# EasyEDA Pro project CerberusZero_V1.epro

# Schematic Schematic1
Board Name: CerberusBeta; Create Date: 2026-01-13; Page Name: USBkillerFrontend; Project Name: Cerberus; Schematic Name: Schematic1; Update Date: 2026-03-24; Company: Glitchboi; Page Size: A4; Version: V1.0
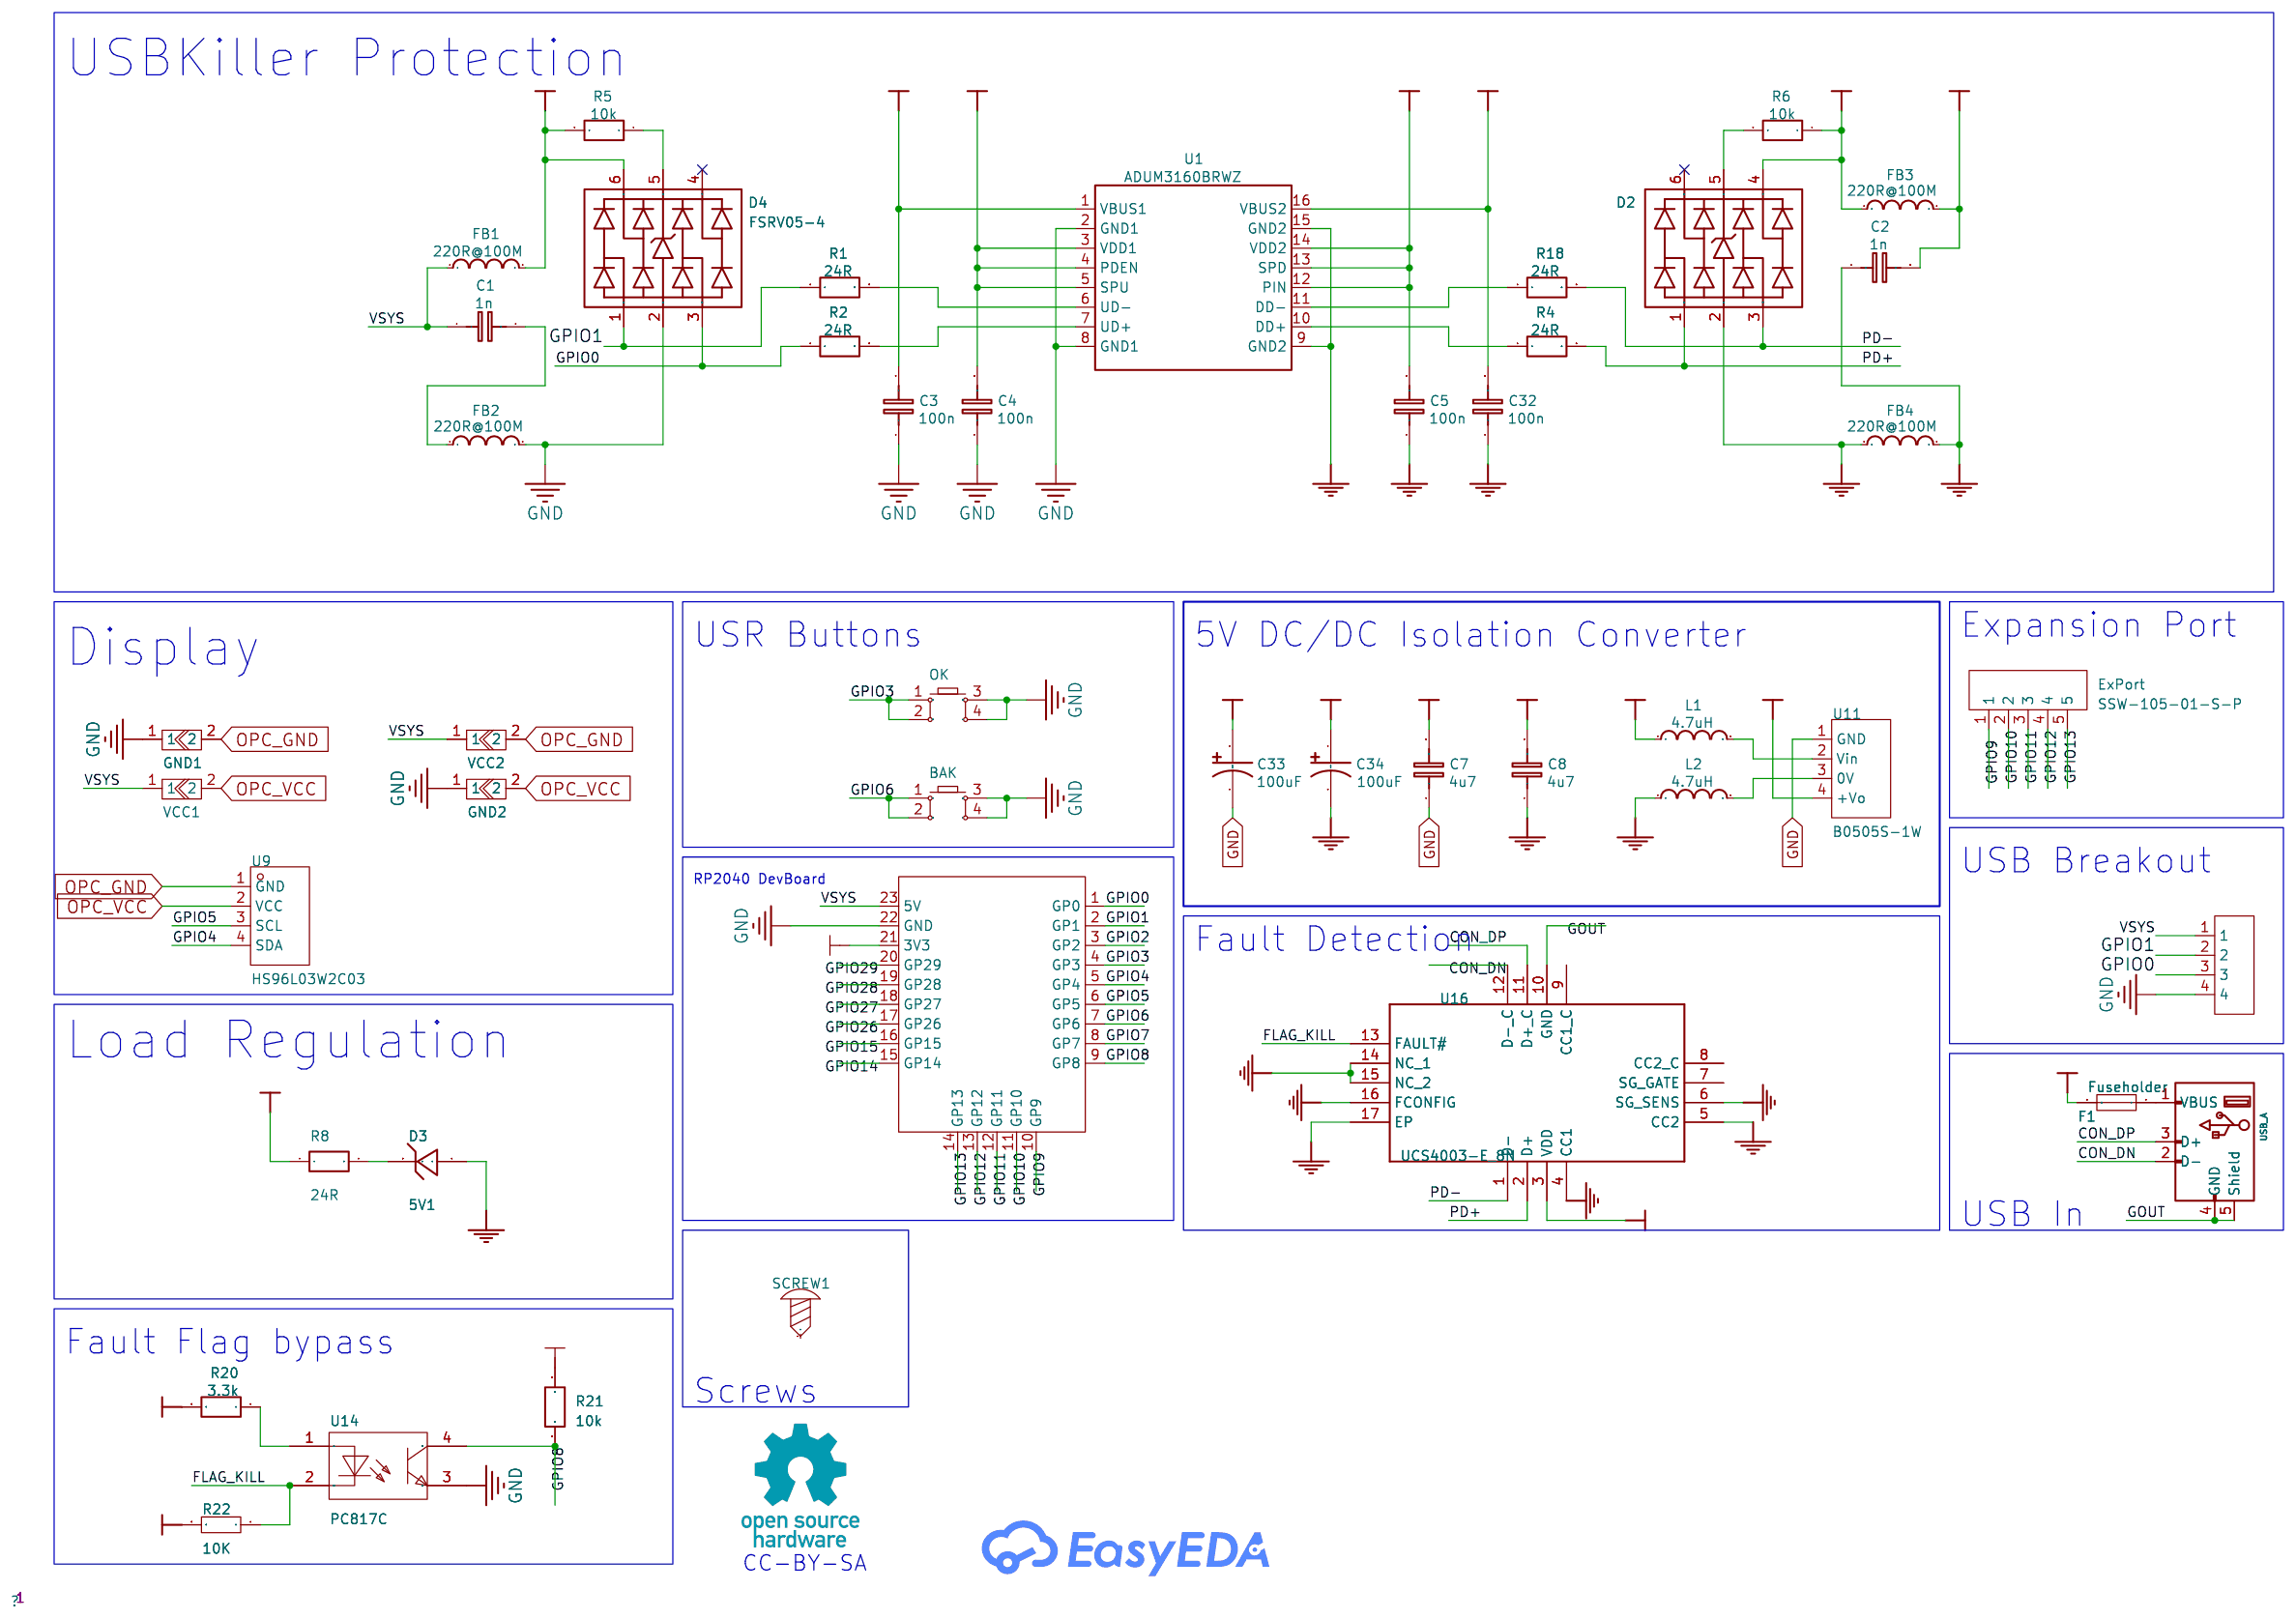
[diagram p0: schematic sheet]

## Parts
BAK  PTS815SJK250SMTRLFS  [SW-SMD_4P-L4.2-W3.3-P2.15-LS5.1]
C1  1n  [C0805]
C2  1n  [C0805]
C3  100n  [C1206]
C4  100n  [C1206]
C5  100n  [C1206]
C7  4u7  [C0603]
C8  4u7  [C0603]
C32  100n  [C1206]
C33  100uF  [C0805]
C34  100uF  [C0805]
D2  FSRV05-4  [SOT-23-6_L2.9-W1.6-P0.95-LS2.8-BL]
D3  5V1  [D1206-RD_S13773]
D4  FSRV05-4  [SRV05-4]
ExPort  SSW-105-01-S-P  [HDR-TH_5P-P2.54_SSW-105-01-S-P]
F1  Fuseholder  [FUSE-SMD_L9.7-W5.0]
FB1  220Ω  [L0603]
FB2  220Ω  [L0603]
FB3  220Ω  [L0603]
FB4  220Ω  [L0603]
GND1  -  [Solder Jumper 0402]
GND2  -  [Solder Jumper 0402]
L1  220Ω  [L0603]
L2  220Ω  [L0603]
OK  PTS815SJK250SMTRLFS  [SW-SMD_4P-L4.2-W3.3-P2.15-LS5.1]
R1  24R  [R1206_1]
R2  24R  [R1206_1]
R4  24R  [R1206_1]
R5  10k  [RES-SMD_L3.2-W1.6_HCS1206FTL500]
R6  10k  [RES-SMD_L3.2-W1.6_HCS1206FTL500]
R8  24R  [R1206_1]
R18  24R  [R1206_1]
R20  3.3k  [RES-SMD_L3.2-W1.6_HCS1206FTL500]
R21  10k  [RES-SMD_L3.2-W1.6_HCS1206FTL500]
R22  10K  [R0603]
SCREW1  -  [SMD_BD6.0-D4.2]
U1  ADUM3160BRWZ  [SOIC-16_L10.3-W7.5-P1.27-LS10.3-TL]
U9  HS96L03W2C03  [OLED-TH_L27.8-W27.2-P2.54_C9900033791]
U11  B0505S-1W  [PWRM-TH_BXXXXS-1W]
U14  PC817C  [DIP-4_L4.6-W6.5-P2.54-LS7.6-BL]
U15  RP2040-Zero  [COMM-SMD_RP2040-ZERO]
U16  UCS4003-E_8N  [QFN50P300X300X100-17N]
USB_B  HX PH254-01-04-Z-L11.5 straight pin header  [HDR-TH_4P-HX-PH254-01-04-Z-L11.5]
USB_IN1  USB_A  [usbCondom:875832010BLF]
VCC1  -  [Solder Jumper 0402]
VCC2  -  [Solder Jumper 0402]

## Library data of the parts
BAK OK = PTS815SJK250SMTRLFS: 操作寿命10万次，使用温度-20°C 至 70°C,尺寸4.20mmx3.20mmx2.50mm，操作力度2.5N; LCSC Part Name: 轻触开关; Supplier Part: C918859; Manufacturer: C&K; Supplier Footprint: SMD; JLCPCB Part Class: 扩展库; Datasheet: https://atta.szlcsc.com/upload/public/pdf/source/20190916/C411883_4F77F16E1D8E48DC707D8949CEE7CF80.pdf; Supplier: LCSC
C1 C2 = 1n: Manufacturer Part: CL10B102KB8NNNC; Supplier: LCSC; Manufacturer: SAMSUNG; Supplier Part: C1588; nameAlias: Value(F); spicePre: C; spiceSymbolName: Cap_0603_EU
C3-C5 C32 = 100n: Manufacturer Part: CC0603KRX7R9BB104; Supplier: LCSC; Manufacturer: YAGEO; Supplier Part: C14663; nameAlias: Value(F); spicePre: C; spiceSymbolName: Cap_0603_EU
C7 C8 = 4u7: Manufacturer Part: CL10A475KO8NNNC; Supplier: LCSC; Manufacturer: SAMSUNG; Supplier Part: C19666; nameAlias: Value(F); spicePre: C; spiceSymbolName: Cap_0603_EU
C33 C34 = 100uF: Supplier: LCSC; Supplier Part: C68621; Manufacturer: AVX; Manufacturer Part: TAJC107M016RNJ; JLCPCB Part Class: Extended Part; nameAlias: Capacitance; Contributor: LCSC; spicePre: C; spiceSymbolName: TAJC107M016RNJ
D2 = FSRV05-4: Polarity:Unidirectional Reverse Stand-Off Voltage (Vrwm):5V Clamping Voltage:18V Peak Pulse Current (Ipp):17A Peak Pulse Power Dissipation (Ppp):300W Voltage - Breakdown:7.5V Reverse Leakage Current (Ir):500nA Number of Channels:4 Operating Temperature:-5; LCSC Part Name: 单向ESD 5V截止 峰值浪涌电流：17A; Supplier Part: C908218; Manufacturer: FUXINSEMI(富芯森美); Supplier Footprint: SOT-23-6L; JLCPCB Part Class: Extended Part; Datasheet: https://item.szlcsc.com/datasheet/FSRV05-4/974460.html; Supplier: LCSC; Polarity: Unidirectional; Reverse Stand-Off Voltage (Vrwm): 5V; Clamping Voltage: 18V; Peak Pulse Current (Ipp): 17A; Peak Pulse Power Dissipation (Ppp): 300W; Voltage - Breakdown: 7.5V; Reverse Leakage Current (Ir): 500nA; Number of Channels: 4; Operating Temperature: -55℃~+125℃; level of protection: IEC 61000-4-5；IEC 61000-4-2; Type: ESD; Junction Capacitance: 0.6pF；0.3pF
D3 = 5V1: Supplier: LCSC; Supplier Part: C81601; Manufacturer: SEMTECH; Manufacturer Part: MM1Z5V1; JLCPCB Part Class: Extend; Contributor: LCSC; LCSC Assembly: Yes; spicePre: D
D4 = FSRV05-4: Manufacturer: FUXINSEMI; Supplier: LCSC; Supplier Part: C908218; Contributor: Stefan Wagner; spicePre: D
ExPort = SSW-105-01-S-P: Pitch:2.54mm Mounting Type:Through Hole Number of Rows:1 Number of Positions:5P Current Rating:4.7A Insulation Height:8.51mm Contact Plating:Tin Operating Temperature:-55℃~+125℃ Operating Temperature:-55℃~+125℃; LCSC Part Name: 间距:2.54mm 直插; Supplier Part: C7322316; Manufacturer: SAMTEC; Supplier Footprint: 插件,P=2.54mm; JLCPCB Part Class: Extended Part; Datasheet: https://atta.szlcsc.com/upload/public/pdf/source/20241016/2BF0BBB15656BB1F7E298D38069FE170.pdf; Supplier: LCSC; Pitch: 2.54mm; Mounting Type: Through Hole; Number of Rows: 1; Number of Positions: 5P; Current Rating: 4.7A; Insulation Height: 8.51mm; Contact Plating: Tin; Operating Temperature: -55℃~+125℃
F1 = 1808 SMD Fuseholder: Supplier Part: C9900157015; Supplier Footprint: SMD-2P; JLCPCB Part Class: Extended Part; Supplier: LCSC
FB1-FB4 = 220R@100M: Supplier Part: C98304; Supplier: LCSC; Manufacturer: Sunlord; Manufacturer Part: UPZ1608E221-2R0TF; JLCPCB Part Class: Extended Part; nameAlias: Value(H); spicePre: L; spiceSymbolName: UPZ1608E221-2R0TF
GND1 GND2 VCC1 VCC2 = Solder Jumper: Solder Jumper for 0402 components
L1 L2 = 4.7uH: Supplier Part: C295681; Supplier: LCSC; Manufacturer: Chilisin Elec; Manufacturer Part: CPY160808T-4R7M-NP; JLCPCB Part Class: Extended Part; nameAlias: Value(H); spicePre: L; spiceSymbolName: UPZ1608E221-2R0TF
R1 R2 R4 R8 R18 = 24R: Manufacturer Part: 0603WAF240JT5E; Supplier: LCSC; Manufacturer: UniOhm; Supplier Part: C4198; nameAlias: Value(Ω); spicePre: R; spiceSymbolName: Res_0603(1/10W)_EU
R5 R6 R20 R21 = 10k: Manufacturer Part: 0603WAF1002T5E; Supplier: LCSC; Manufacturer: UniOhm; Supplier Part: C25804; nameAlias: Value(Ω); spicePre: R; spiceSymbolName: Res_0805(1/8W)_EU
R22 = Res_0603: Supplier Footprint: 0603
SCREW1 = Screw-Hole-M3: Supplier Footprint: 插件
U1 = ADUM3160BRWZ: Supplier: LCSC; Manufacturer: ADI; Supplier Part: C108501; JLCPCB Part Class: Extended Part; Contributor: LCSC; spicePre: U
U9 = HS96L03W2C03: Main Control Chip:SSD1315 Interface Type:I2C Size:0.96 Pixel Resolution:128x64 Operating Temperature:-40℃~+70℃ Operating Temperature:-40℃~+70℃; LCSC Part Name: 0.96寸OLED显示屏窄白光IIC; Supplier Part: C5248080; Manufacturer: HS(汉昇); JLCPCB Part Class: Extended Part; Datasheet: https://atta.szlcsc.com/upload/public/pdf/source/20230627/763D01F79A90007632F098068C7C8AD9.pdf; Supplier: LCSC; Main Control Chip: SSD1315; Interface Type: I2C; Size: 0.96; Pixel Resolution: 128x64; Operating Temperature: -40℃~+70℃
U11 = B0505S-1W_C2880020: Number of Outputs:1 Output Power:1W Voltage - Supply:5.5V Voltage - Supply:5.5V Conversion Efficiency:70% Conversion Efficiency:70% Output Voltage:5V Output Voltage:5V Output Current(Max):200mA Output Current(Max):200mA Capacitive Load(Max):100uF Isolatio; LCSC Part Name: DC-DC 电源模块; Supplier Part: C2880020; Manufacturer: TESL*A(清远特斯拉); Supplier Footprint: SIP,11.6x6mm; JLCPCB Part Class: Extended Part; Datasheet: https://item.szlcsc.com/datasheet/B0505S-1W/3089557.html; Supplier: LCSC; Number of Outputs: 1; Output Power: 1W; Voltage - Supply: 5.5V; Conversion Efficiency: 70%; Output Voltage: 5V; Output Current(Max): 200mA; Capacitive Load(Max): 100uF; Isolation Voltage(Vrms): 1kV; Operating Temperature: -40℃~+85℃; Ripple Noise: 50mVp-p; Length: 11.6mm; Width: 6mm; Height: 10mm
U14 = PC817C_C20612449: Input type:DC Output Type:Phototransistor Voltage - Forward(Vf):1.2V Output Current:50mA Isolation Voltage(Vrms):5kV Reverse Voltage:6V Load Voltage:35V Number of Outputs:1 Vce Saturation(VCE(sat)):100mV@20mA,1mA Rise time:18us Fall time:18us Operating Te; LCSC Part Name: 4引脚DIP封装光电晶体管光电耦合器; Supplier Part: C20612449; Manufacturer: KTP(科泰普); Supplier Footprint: DIP-4; JLCPCB Part Class: Extended Part; Datasheet: https://item.szlcsc.com/datasheet/PC817C/21971288.html; Supplier: LCSC; Input type: DC; Output Type: Phototransistor; Voltage - Forward(Vf): 1.2V; Output Current: 50mA; Isolation Voltage(Vrms): 5kV; Reverse Voltage: 6V; Load Voltage: 35V; Number of Outputs: 1; Vce Saturation(VCE(sat)): 100mV@20mA,1mA; Rise time: 18us; Fall time: 18us; Operating Temperature: -55℃~+110℃; Current Transfer Ratio (CTR) Minimum: 200%; Current Transfer Ratio (CTR) Maximum/Saturation Value: 400%; Total Power Dissipation(Pd): 200mW; Forward Current(If): 60mA
U15 = RP2040-Zero: LCSC Part Name: 微雪 树莓派RP2040-Zero微控制器 PICO开发板 RP2040双核处理器; Supplier Part: C5350143; Manufacturer: Waveshare(微雪电子); JLCPCB Part Class: Extended Part; Datasheet: https://item.szlcsc.com/datasheet/RP2040-Zero/6136910.html; Supplier: LCSC
U16 = UCS4003-E_8N: USB Interface IC USB Type-C Port Protector
USB_B = HX PH254-01-04-Z-L11.5 straight pin header: Pin Structure:1x4P Pitch:2.54mm Circluar Pins/Square Pins:Pin Header Mounting Type:Through Hole Number of Rows:1 Number of Pins:4P Current Rating:3A Voltage Rating (Max):1kV Length of Mating Pin:6mm Insulation Height:2.5mm Length of End Connection Pin:3mm; LCSC Part Name: 1x4P 间距:2.54mm 方针 直插; Supplier Part: C52016392; Manufacturer: hanxia(韩下); Supplier Footprint: 插件,P=2.54mm; JLCPCB Part Class: Extended Part; Datasheet: https://item.szlcsc.com/datasheet/HX%2520PH254-01-04-Z-L11.5%2520straight%2520pin%2520header/54760437.html; Supplier: LCSC; Pin Structure: 1x4P; Pitch: 2.54mm; Circluar Pins/Square Pins: Pin Header; Mounting Type: Through Hole; Number of Rows: 1; Number of Pins: 4P; Current Rating: 3A; Voltage Rating (Max): 1kV; Length of Mating Pin: 6mm; Insulation Height: 2.5mm; Length of End Connection Pin: 3mm; Contact Material: Brass; Contact Plating: Gold; Operating Temperature: -40℃~+105℃
USB_IN1 = Connector_USB_A: Attribute1: J2; LCSC#: C599118

## Nets
3V3: R21.2 U15.21(3V3)
GND: BAK.3 BAK.4 C3.1 C4.1 C7.1 C33.2 D4.2 FB2.2 GND1.1 GND2.1 OK.3 OK.4 U1.2(GND1) U1.8(GND1) U11.1(GND) U14.3(EM) U15.22(GND) USB_B.4
GND2: C5.1 C8.1 C32.1 C34.2 D2.2 FB4.1 L2.1 U1.9(GND2) U1.15(GND2) U16.4(CC1) U16.5(CC2) U16.6(SG_SENS) U16.14(NC_1) U16.15(NC_2) U16.16(FCONFIG) U16.17(EP)
VBUS1: C3.2 C7.2 C33.1 D4.6 FB1.2 L1.1 R5.2 U1.1(VBUS1)
VBUS2: C8.2 C32.2 C34.1 D2.4 FB3.1 R6.1 R20.2 R22.2 U1.16(VBUS2) U11.4(+Vo) U16.3(VDD)
VDD1: C4.2 U1.3(VDD1) U1.4(PDEN) U1.5(SPU)
VDD2: C5.2 U1.12(PIN) U1.13(SPD) U1.14(VDD2)
CON_DN: U16.12(D-_C) USB_IN1.2(D-)
CON_DP: U16.11(D+_C) USB_IN1.3(D+)
FLAG_KILL: R22.1 U14.2(CAT) U16.13(FAULT#)
GOUT: C2.1 D3.1(A) FB4.2 U16.10(GND) USB_IN1.4(GND) USB_IN1.5(Shield)
GPIO0: D4.3 R2.1 U15.1(GP0) USB_B.3
GPIO1: D4.1 R1.1 U15.2(GP1) USB_B.2
GPIO2: U15.3(GP2)
GPIO3: OK.1 OK.2 U15.4(GP3)
GPIO4: U9.4(SDA) U15.5(GP4)
GPIO5: U9.3(SCL) U15.6(GP5)
GPIO6: BAK.1 BAK.2 U15.7(GP6)
GPIO7: U15.8(GP7)
GPIO8: R21.1 U14.4(COL) U15.9(GP8)
GPIO9: ExPort.1 U15.10(GP9)
GPIO10: ExPort.2 U15.11(GP10)
GPIO11: ExPort.3 U15.12(GP11)
GPIO12: ExPort.4 U15.13(GP12)
GPIO13: ExPort.5 U15.14(GP13)
GPIO14: U15.15(GP14)
GPIO15: U15.16(GP15)
GPIO26: U15.17(GP26)
GPIO27: U15.18(GP27)
GPIO28: U15.19(GP28)
GPIO29: U15.20(GP29)
OPC_GND: GND1.2 U9.1(GND) VCC2.2
OPC_VCC: GND2.2 U9.2(VCC) VCC1.2
PD+: D2.1 R4.2 U16.2(D+)
PD-: D2.3 R18.2 U16.1(D-)
VOUT: C2.2 F1.2 FB3.2 R8.1
VSYS: C1.1 FB1.1 U15.23(5V) USB_B.1 VCC1.1 VCC2.1
$2N7232: D3.2(K) R8.2
$2N7998: C1.2 FB2.1
$2N8019: R1.2 U1.6(UD-)
$2N8020: R2.2 U1.7(UD+)
$2N8021: R4.1 U1.10(DD+)
$2N8022: R18.1 U1.11(DD-)
$2N8023: D4.5 R5.1
$2N8024: D2.5 R6.2
$2N8501: L1.2 U11.2(Vin)
$2N8502: L2.2 U11.3(0V)
$2N13465: R20.1 U14.1(AN)
$2N18746: F1.1 USB_IN1.1(VBUS)

Not connected (* = marked no-connect by the designer): D2 6*; D4 4*; SCREW1 1; U16 7(SG_GATE) 8(CC2_C) 9(CC1_C)

## Notes on the sheet
- USBKiller Protection
- Expansion Port
- Display
- USR Buttons
- 5V DC/DC Isolation Converter
- USB Breakout
- RP2040 DevBoard
- Fault Detection
- Load Regulation
- USB In
- Fault Flag bypass
- Screws
- CC-BY-SA

# Board CerberusZero
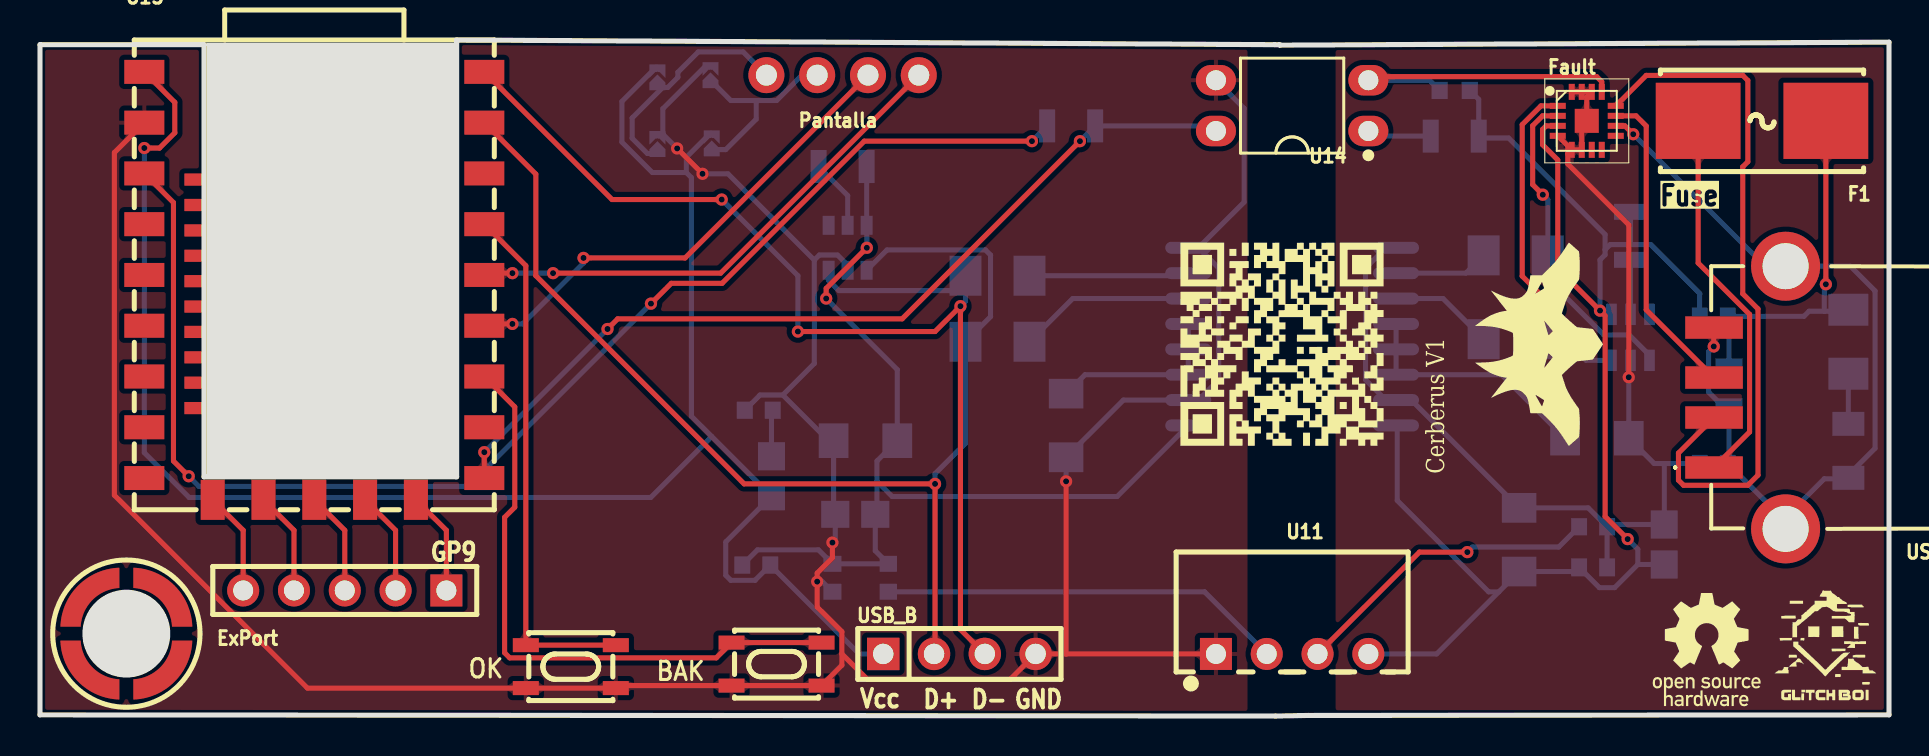
[diagram p1: board, top side]
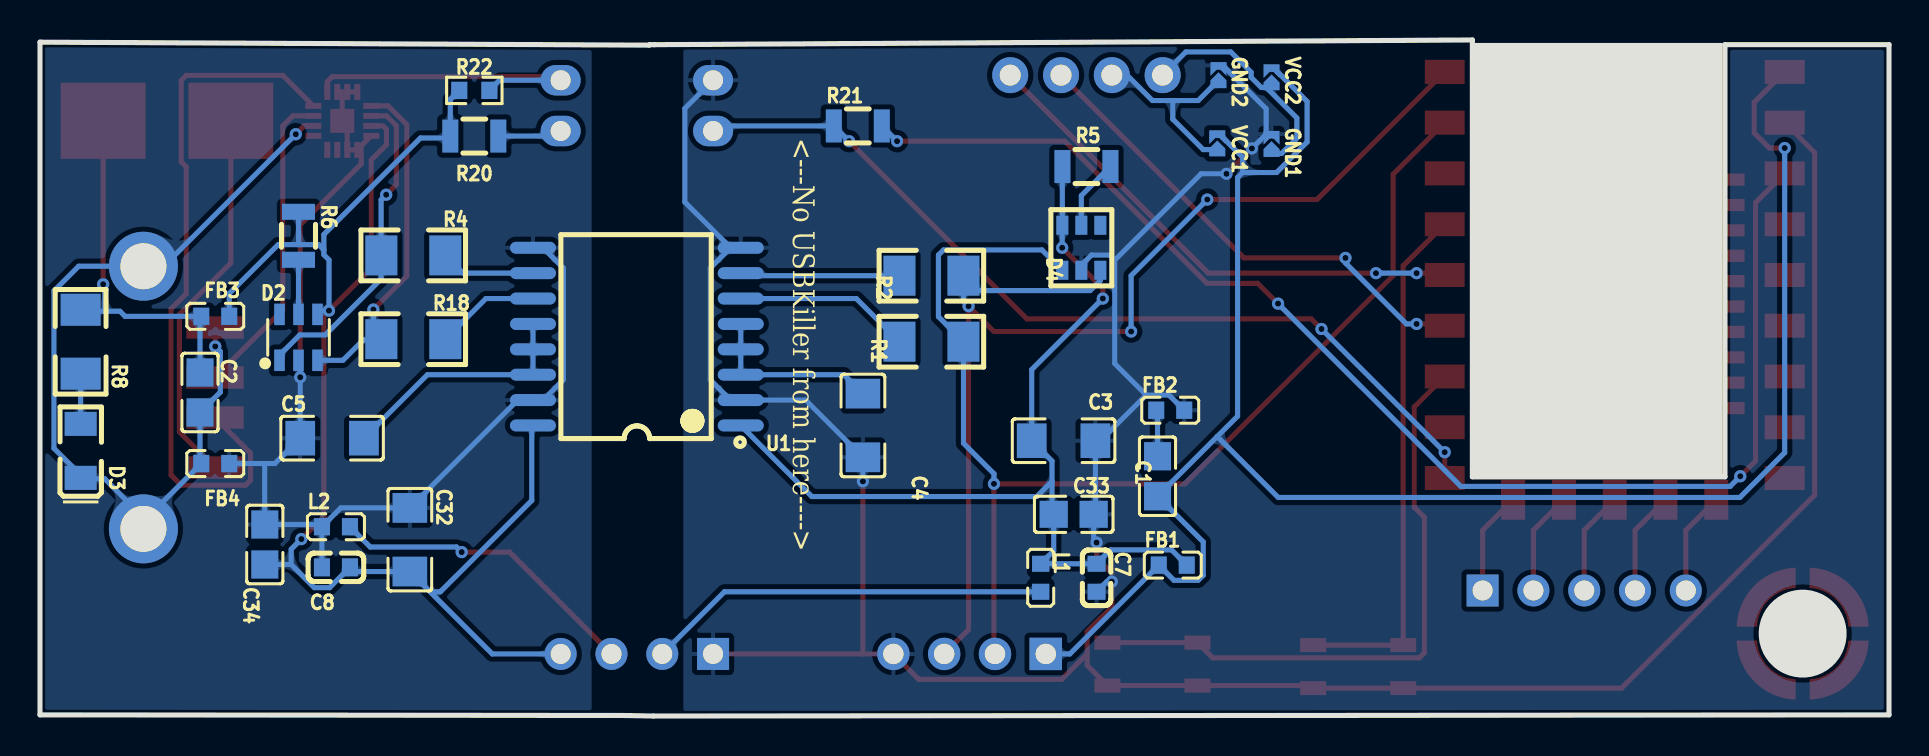
[diagram p2: board, bottom side, seen from below]

Outline 92.46 x 33.82 mm; copper layers: Top Layer, Bottom Layer. Coordinates in mm from the lower left corner of the outline.
Outline path: 0,33.59 0,0.06 61.78,0 63.41,0.03 92.46,0.06 92.46,33.71 62,33.56 61.98,33.59 61.72,33.59 20.83,33.82 20.83,11.97 8.2,11.97 8.2,33.59 0,33.59
Stack: Top Layer 0.035mm / Dielectric1 1.51mm FR4 er 4.5 / Bottom Layer 0.035mm

## Design rules (mm)
template: JLCPCB Capability(Two Layers Board)
spacing copperThickness1oz (default): track to track 0.102, other pairs 0.152 to 0.3
spacing copperThickness2oz: track to track 0.203, other pairs 0.152 to 0.3
track width copperThickness1oz (default): min 0.127, default 0.254, max 2.54
track width copperThickness2oz: min 0.203, default 0.254, max 2.54
differential pair differentialPair (default): width min 0.127, default 0.254, max 2.54; gap min 0.152, default 0.152
via viaSize (default): diameter min 0.5, default 0.61, max 10; hole min 0.3, default 0.305, max 6.3
net VBUS2 uses copperThickness2oz

## Placement (name value [footprint] x y rotation side)
BAK  PTS815SJK250SMTRLFS  [SW-SMD_4P-L4.2-W3.3-P2.15-LS5.1]  36.83 2.6 0 top
C1  1n  [C0805]  36.58 12 90 bottom
C2  1n  [C0805]  84.45 16.19 90 bottom
C3  100n  [C1206]  41.27 13.77 0 bottom
C4  100n  [C1206]  51.31 14.54 90 bottom
C5  100n  [C1206]  77.85 13.9 180 bottom
C7  4u7  [C0603]  39.62 6.92 90 bottom
C8  4u7  [C0603]  77.66 7.44 180 bottom
C32  100n  [C1206]  73.96 8.82 270 bottom
C33  100uF  [C0805]  40.77 10.09 180 bottom
C34  100uF  [C0805]  81.21 8.58 90 bottom
D2  FSRV05-4  [SOT-23-6_L2.9-W1.6-P0.95-LS2.8-BL]  79.53 18.94 180 bottom
D3  5V1  [D1206-RD_S13773]  90.42 13.27 90 bottom
D4  FSRV05-4  [SRV05-4]  40.39 23.43 90 bottom
ExPort  SSW-105-01-S-P  [HDR-TH_5P-P2.54_SSW-105-01-S-P]  15.24 6.28 180 top
F1  Fuseholder  [FUSE-SMD_L9.7-W5.0]  86.11 29.78 0 top
Fault  UCS4003-E_8N  [QFN50P300X300X100-17N]  77.34 29.78 0 top
FB1  220Ω  [L0603]  35.81 7.55 180 bottom
FB2  220Ω  [L0603]  35.94 15.3 180 bottom
FB3  220Ω  [L0603]  83.69 20 0 bottom
FB4  220Ω  [L0603]  83.69 12.63 0 bottom
GND1  -  [Solder Jumper 0402]  30.87 28.62 270 bottom
GND2  -  [Solder Jumper 0402]  33.53 32.06 270 bottom
L1  220Ω  [L0603]  42.42 6.92 270 bottom
L2  220Ω  [L0603]  77.66 9.47 180 bottom
OK  PTS815SJK250SMTRLFS  [SW-SMD_4P-L4.2-W3.3-P2.15-LS5.1]  26.54 2.47 0 top
Pantalla  HS96L03W2C03  [OLED-TH_L27.8-W27.2-P2.54_C9900033791]  40.13 32.06 0 top
R1  24R  [R1206_1]  47.88 18.73 0 bottom
R2  24R  [R1206_1]  47.88 22.03 0 bottom
R4  24R  [R1206_1]  73.79 23.05 0 bottom
R5  10k  [RES-SMD_L3.2-W1.6_HCS1206FTL500]  40.13 27.49 0 bottom
R6  10k  [RES-SMD_L3.2-W1.6_HCS1206FTL500]  79.53 24.02 270 bottom
R8  24R  [R1206_1]  90.42 18.73 270 bottom
R18  24R  [R1206_1]  73.79 18.85 0 bottom
R20  3.3k  [RES-SMD_L3.2-W1.6_HCS1206FTL500]  70.74 29.01 0 bottom
R21  10k  [RES-SMD_L3.2-W1.6_HCS1206FTL500]  51.56 29.52 180 bottom
R22  10K  [R0603]  70.74 31.3 0 bottom
SCREW1  -  [SMD_BD6.0-D4.2]  4.32 4.12 0 top
U1  ADUM3160BRWZ  [SOIC-16_L10.3-W7.5-P1.27-LS10.3-TL]  62.61 18.98 0 bottom
U11  B0505S-1W  [PWRM-TH_BXXXXS-1W]  62.61 3.11 0 top
U14  PC817C  [DIP-4_L4.6-W6.5-P2.54-LS7.6-BL]  62.61 30.54 90 top
U15  RP2040-Zero  [COMM-SMD_RP2040-ZERO]  13.72 21.52 0 top
USB_B  HX PH254-01-04-Z-L11.5 straight pin header  [HDR-TH_4P-HX-PH254-01-04-Z-L11.5]  45.97 3.11 0 top
USB_IN1  USB_A  [usbCondom:875832010BLF]  89.92 15.93 90 top
VCC1  -  [Solder Jumper 0402]  33.59 28.65 270 bottom
VCC2  -  [Solder Jumper 0402]  30.87 31.95 270 bottom

## Footprints (pads in the part's own frame, mm; a bottom-side part is the same pattern mirrored in y, then rotated)
C0603
  rect 0.8x0.9 smd: 1(-0.7,0) 2(0.7,0)
C0805
  rect 1.41x1.35 smd: 1(-1,0) 2(1,0)
C1206
  rect 1.485x1.728 smd: 1(-1.593,0) 2(1.593,0)
COMM-SMD_RP2040-ZERO
  rect 2x1.2 smd: 1(8.5,10.705) 2(8.5,8.165) 3(8.5,5.625) 4(8.5,3.085) 5(8.5,0.545) 6(8.5,-1.995) 7(8.5,-4.535) 8(8.5,-7.075) 9(8.5,-9.615) 15(-8.5,-9.615) 16(-8.5,-7.075) 17(-8.5,-4.535) 18(-8.5,-1.995) 19(-8.5,0.545) 20(-8.5,3.085) 21(-8.5,5.625) 22(-8.5,8.165) 23(-8.5,10.705)
  rect 1.2x2 smd: 10(5.08,-10.705) 11(2.54,-10.705) 12(0,-10.705) 13(-2.54,-10.705) 14(-5.08,-10.705)
  rect 1.01x0.61 smd: 24(-5.99,-6.115) 25(-5.99,-4.845) 26(-5.99,-3.575) 27(-5.99,-2.305) 28(-5.99,-1.035) 29(-5.99,0.235) 30(-5.99,1.505) 31(-5.99,2.775) 32(-5.99,4.045) 33(-5.99,5.315)
D1206-RD_S13773
  rect 1.2x1.6 smd: 1(-1.35,0) 2(1.35,0)
DIP-4_L4.6-W6.5-P2.54-LS7.6-BL
  oval 1.524x2 hole 1: 1(-1.27,-3.81) 2(1.27,-3.81) 3(1.27,3.81) 4(-1.27,3.81)
FUSE-SMD_L9.7-W5.0
  rect 4.24x3.81 smd: 1(-3.192,0) 2(3.192,0)
HDR-TH_4P-HX-PH254-01-04-Z-L11.5
  rect 1.62x1.62 hole 1.02: 1(-3.81,0)
  round 1.62 hole 1.02: 2(-1.27,0) 3(1.27,0) 4(3.81,0)
HDR-TH_5P-P2.54_SSW-105-01-S-P
  rect 1.6x1.6 hole 1: 1(-5.08,0)
  round 1.6 hole 1: 2(-2.54,0) 3(0,0) 4(2.54,0) 5(5.08,0)
L0603
  rect 0.8x0.864 smd: 1(-0.7,0) 2(0.7,0)
OLED-TH_L27.8-W27.2-P2.54_C9900033791
  round 1.8 hole 1.05: 1(-3.81,0) 2(-1.27,0) 3(1.27,0) 4(3.81,0)
PWRM-TH_BXXXXS-1W
  rect 1.6x1.6 hole 1: 1(-3.81,0)
  round 1.6 hole 1: 2(-1.27,0) 3(1.27,0) 4(3.81,0)
QFN50P300X300X100-17N
  rect 0.8x0.3 smd: 1(-1.45,0.75) 2(-1.45,0.25) 3(-1.45,-0.25) 4(-1.45,-0.75) 9(1.45,-0.75) 10(1.45,-0.25) 11(1.45,0.25) 12(1.45,0.75)
  rect 0.3x0.8 smd: 5(-0.75,-1.45) 6(-0.25,-1.45) 7(0.25,-1.45) 8(0.75,-1.45) 13(0.75,1.45) 14(0.25,1.45) 15(-0.25,1.45) 16(-0.75,1.45)
  rect 1.2x1.2 smd: 17(0,0)
R0603
  rect 0.806x0.864 smd: 1(-0.753,0) 2(0.753,0)
R1206_1
  rect 1.6x2 smd: 1(-1.6,0) 2(1.6,0)
RES-SMD_L3.2-W1.6_HCS1206FTL500
  rect 0.8x1.65 smd: 1(-1.2,0) 2(1.2,0)
SMD_BD6.0-D4.2
  custom 2.948x2.948 smd: 1(-1.824,2.201) 1(-1.824,-2.201) 1(1.824,2.201) 1(1.824,-2.202)
SOIC-16_L10.3-W7.5-P1.27-LS10.3-TL
  oval 2.3x0.6 smd: 1(-5.194,4.445) 2(-5.194,3.175) 3(-5.194,1.905) 4(-5.194,0.635) 5(-5.194,-0.635) 6(-5.194,-1.905) 7(-5.194,-3.175) 8(-5.194,-4.445) 9(5.194,-4.445) 10(5.194,-3.175) 11(5.194,-1.905) 12(5.194,-0.635) 13(5.194,0.635) 14(5.194,1.905) 15(5.194,3.175) 16(5.194,4.445)
Solder Jumper 0402
  custom 0.685x0.8 smd: 1(-0.491,0)
  custom 0.79x0.8 smd: 2(0.256,0)
SOT-23-6_L2.9-W1.6-P0.95-LS2.8-BL
  rect 0.532x1.072 smd: 1(-0.95,-1.149) 2(0,-1.149) 3(0.95,-1.149) 4(0.95,1.149) 5(0,1.149) 6(-0.95,1.149)
SRV05-4
  rect 0.95x0.6 smd: 1(-1.125,0.95) 2(-1.125,0) 3(-1.125,-0.95) 4(1.125,-0.95) 5(1.125,0) 6(1.125,0.95)
SW-SMD_4P-L4.2-W3.3-P2.15-LS5.1
  rect 1.3x0.701 smd: 1(-2.251,1.075) 2(2.251,1.075) 3(-2.251,-1.075) 4(2.251,-1.075)
usbCondom:875832010BLF
  rect 1.12x2.88 smd: 1(-3.5,6.21) 2(-1,6.21) 3(1,6.21) 4(3.5,6.21)
  round 3.45 hole 2.3: 5(-6.57,2.63) 5(6.57,2.63)

## Nets
3V3: R21.2 U15.21
GND: BAK.3 BAK.4 C3.1 C4.1 C7.1 C33.2 D4.2 FB2.2 GND1.1 GND2.1 OK.3 OK.4 U1.2 U1.8 U11.1 U14.3 U15.22 USB_B.4
GND2: C5.1 C8.1 C32.1 C34.2 D2.2 Fault.4 Fault.5 Fault.6 Fault.14 Fault.15 Fault.16 Fault.17 FB4.1 L2.1 U1.9 U1.15
VBUS1: C3.2 C7.2 C33.1 D4.6 FB1.2 L1.1 R5.2 U1.1
VBUS2: C8.2 C32.2 C34.1 D2.4 Fault.3 FB3.1 R6.1 R20.2 R22.2 U1.16 U11.4
VDD1: C4.2 U1.3 U1.4 U1.5
VDD2: C5.2 U1.12 U1.13 U1.14
CON_DN: Fault.12 USB_IN1.2
CON_DP: Fault.11 USB_IN1.3
FLAG_KILL: Fault.13 R22.1 U14.2
GOUT: C2.1 D3.1 Fault.10 FB4.2 USB_IN1.4 USB_IN1.5
GPIO0: D4.3 R2.1 U15.1 USB_B.3
GPIO1: D4.1 R1.1 U15.2 USB_B.2
GPIO2: U15.3
GPIO3: OK.1 OK.2 U15.4
GPIO4: Pantalla.4 U15.5
GPIO5: Pantalla.3 U15.6
GPIO6: BAK.1 BAK.2 U15.7
GPIO7: U15.8
GPIO8: R21.1 U14.4 U15.9
GPIO9: ExPort.1 U15.10
GPIO10: ExPort.2 U15.11
GPIO11: ExPort.3 U15.12
GPIO12: ExPort.4 U15.13
GPIO13: ExPort.5 U15.14
GPIO14: U15.15
GPIO15: U15.16
GPIO26: U15.17
GPIO27: U15.18
GPIO28: U15.19
GPIO29: U15.20
OPC_GND: GND1.2 Pantalla.1 VCC2.2
OPC_VCC: GND2.2 Pantalla.2 VCC1.2
PD+: D2.1 Fault.2 R4.2
PD-: D2.3 Fault.1 R18.2
VOUT: C2.2 F1.2 FB3.2 R8.1
VSYS: C1.1 FB1.1 U15.23 USB_B.1 VCC1.1 VCC2.1
$2N7232: D3.2 R8.2
$2N7998: C1.2 FB2.1
$2N8019: R1.2 U1.6
$2N8020: R2.2 U1.7
$2N8021: R4.1 U1.10
$2N8022: R18.1 U1.11
$2N8023: D4.5 R5.1
$2N8024: D2.5 R6.2
$2N8501: L1.2 U11.2
$2N8502: L2.2 U11.3
$2N13465: R20.1 U14.1
$2N18746: F1.1 USB_IN1.1

Pads without a net: D2 6; D4 4; Fault 7 8 9; SCREW1 1; U15 24 25 26 27 28 29 30 31 32 33

## Via types
v1: diameter 0.61, hole 0.305, Top Layer to Bottom Layer, 31 vias

## Routing (per net, layer and track width the routed paths; a pad name or vN(x,y) marks a point on that pad's centre or on a via; arc(x,y) is an arc through that point)
3V3: length 66.7
  Top Layer w0.254: v1(30.55,20.63) 31.57,21.65 34.11,21.65 41.22,28.76 v1(49.6,28.76) ; U15.21 6.67,25.69 6.67,12.76 v1(7.44,12)
  Bottom Layer w0.254: v1(7.44,12) 7.94,11.49 21.41,11.49 v1(30.55,20.63) ; R21.2 v1(49.6,28.76)
GND: length 159.9
  Top Layer w0.254: 51.31,3.11 v1(51.31,11.74) ; 51.31,3.11 U11.1 ; 51.31,3.11 USB_B.4 48.51,1.84 41.37,1.84 40.1,3.11 ; 40.1,3.11 40.1,2.54 BAK.4 BAK.3 28.92,1.52 OK.4 OK.3 13.37,1.4 3.72,11.05 3.72,28.19 U15.22 ; 40.1,3.11 40.1,4.22 38.86,5.45 v1(38.86,6.72) 38.86,7.15 39.62,7.92 v1(39.62,8.68) ; v1(33.13,27.13) v1(31.86,28.4)
  Bottom Layer w0.254: 31.14,29.11 31.14,30.38 33.32,32.55 GND2.1 ; 31.14,29.11 GND1.1 ; 31.14,29.11 v1(31.86,28.4) ; v1(33.13,27.13) 34.4,27.13 38.72,22.81 ; FB2.2 36,16.06 37.14,16.06 ; v1(38.86,6.72) 39.12,6.72 C7.1 ; 57.92,23.43 58.94,22.41 58.94,16.82 57.92,15.81 U1.2 54.17,15.81 C4.1 v1(51.31,11.74) ; 57.92,23.43 60.21,25.71 60.21,30.4 U14.3 ; 57.92,23.43 U1.8 ; 37.14,16.06 39.43,13.77 C3.1 39.68,10.18 C33.2 39.77,8.82 v1(39.62,8.68) ; 37.14,16.06 38.72,17.63 38.72,22.81 ; 38.72,22.81 38.97,23.06 39.88,23.06 40.39,22.55 D4.2
GND2: length 57.1
  Top Layer w0.254: 76.4,28.12 Fault.5 Fault.6 77.09,29.53 Fault.17 77.34,30.98 Fault.14 Fault.15 Fault.16 ; 76.4,28.12 76.4,27.62 79.44,24.57 v1(79.44,16.95) ; 76.4,28.12 76.4,28.52 75.89,29.03
  Bottom Layer w0.254: L2.1 77.42,10.41 C32.1 68.57,15.81 U1.15 67.3,15.81 66.28,16.82 66.28,22.41 67.3,23.43 U1.9 ; L2.1 C8.1 ; L2.1 78.47,9.58 C34.2 ; 81.22,12.63 81.22,9.59 ; 81.22,12.63 FB4.1 ; 81.22,12.63 80.71,12.63 C5.1 v1(79.44,16.95) 79.44,17.71 D2.2
VBUS1: length 48.2
  Top Layer w0.254: v1(39.31,20.89) 39.31,21.39 v1(41.34,23.43)
  Bottom Layer w0.254: 41.85,11.74 41.85,12.76 C3.2 42.87,17.33 v1(39.31,20.89) ; 41.85,11.74 41.85,10.18 C33.1 41.77,8.27 L1.1 C7.2 38.93,8.31 35.88,8.31 FB1.2 ; 41.85,11.74 42.61,10.98 53.86,10.98 U1.1 ; v1(41.34,23.43) 41.34,24.54 D4.6 41.34,27.49
VBUS2: length 76.8
  Top Layer w0.254: 75.89,29.53 75.31,29.53 75.13,29.34 75.13,28.58 75.89,27.82 75.89,22.39 v1(78.01,20.28) 78.26,20.03 78.26,9.98 v1(79.39,8.85)
  Bottom Layer w0.254: 78.26,23.33 78.51,23.58 79.53,23.58 ; 78.26,23.33 78.26,23.08 78.01,22.82 v1(78.01,20.28) 78.39,20.28 D2.4 ; 78.26,23.33 78.26,24.09 73.43,28.92 72.04,28.92 71.94,29.01 71.94,30.85 R22.2 ; 79.9,7.58 C34.1 ; 79.9,7.58 79.9,8.34 v1(79.39,8.85) ; 79.9,7.58 78.74,6.42 77.98,6.42 C8.2 76.75,7.23 C32.2 72.95,6.21 ; 79.53,23.58 80.55,23.58 82.99,21.14 FB3.1 ; 79.53,23.58 R6.1 ; 72.95,6.21 69.84,3.11 U11.4 ; 72.95,6.21 72.44,6.21 67.87,10.78 67.87,14.48 U1.16
VDD1: length 9
  Bottom Layer w0.254: C4.2 52.26,17.08 U1.3 U1.4 U1.5
VDD2: length 12.3
  Bottom Layer w0.254: C5.2 73.08,17.08 U1.14 U1.13 U1.12
CON_DN: length 35.7
  Top Layer w0.254: USB_IN1.2 81.93,13.16 81.93,11.8 82.18,11.54 85.4,11.54 85.9,12.05 85.9,20.37 85.14,21.13 85.14,27.48 85.4,27.73 85.4,31.8 85.14,32.05 80.32,32.05 Fault.12
CON_DP: length 15.7
  Top Layer w0.254: Fault.11 79.81,30.03 80.32,29.52 80.32,20.32 USB_IN1.3
FLAG_KILL: length 16.1
  Top Layer w0.254: Fault.13 78.09,31.73 77.84,31.99 66.6,31.99 U14.2
  Bottom Layer w0.254: U14.2 69.48,31.81 R22.1
GOUT: length 42.3
  Top Layer w0.254: Fault.10 79.25,29.53 v1(79.67,29.11) ; USB_IN1.4 83.69,19.42 v1(83.69,18.49)
  Bottom Layer w0.254: v1(79.67,29.11) 86.27,22.5 USB_IN1.5 90.52,22.5 91.76,21.27 91.76,13.39 90.23,11.87 ; USB_IN1.5 87.19,9.46 87.19,9.84 ; 87.19,9.84 89.22,11.87 90.23,11.87 ; 87.19,9.84 FB4.2 84.45,12.69 C2.1 83.44,16.2 83.44,18.23 v1(83.69,18.49) ; 90.23,11.87 D3.1
GPIO0: length 58.8
  Top Layer w0.254: USB_B.3 46.02,4.32 v1(46.02,20.5) 44.75,19.23 v1(37.9,19.23) ; v1(34.09,25.84) 28.6,25.84 U15.1
  Bottom Layer w0.254: v1(46.02,20.5) 46.28,20.76 R2.1 45.53,21.28 39.94,21.28 39.44,21.79 D4.3 ; v1(37.9,19.23) 37.9,22.03 v1(34.09,25.84)
GPIO1: length 60.8
  Top Layer w0.254: U15.2 24.79,27.11 24.79,22.03 35.21,11.61 v1(44.75,11.61) 44.75,3.16 USB_B.2
  Bottom Layer w0.254: v1(44.75,11.61) 44.75,12.12 46.28,13.65 R1.1 47.53,19.98 47.53,23.06 47.28,23.32 42.35,23.32 D4.1
GPIO3: length 26.4
  Top Layer w0.254: OK.2 OK.1 24.29,22.53 U15.4
GPIO4: length 25.9
  Top Layer w0.254: v1(23.62,22.16) 22.31,22.16 U15.5 ; v1(25.65,22.16) 34.04,22.16 Pantalla.4
  Bottom Layer w0.254: v1(25.65,22.16) v1(23.62,22.16)
GPIO5: length 24.5
  Top Layer w0.254: U15.6 22.31,19.62 v1(23.62,19.62) ; v1(27.18,22.92) 32.26,22.92 Pantalla.3
  Bottom Layer w0.254: v1(23.62,19.62) 24.13,19.62 27.18,22.66 v1(27.18,22.92)
GPIO6: length 30.9
  Top Layer w0.254: U15.7 23.74,15.46 23.74,10.45 23.23,9.94 23.23,3.16 23.49,2.91 33.82,2.91 BAK.1 BAK.2
GPIO8: length 44.7
  Top Layer w0.254: v1(28.38,19.36) 28.89,19.87 43.11,19.87 v1(52,28.76) ; v1(22.22,13.2) U15.9
  Bottom Layer w0.254: v1(28.38,19.36) v1(22.22,13.2) ; U14.4 58.55,29.52 R21.1 v1(52,28.76)
GPIO9: length 5.2
  Top Layer w0.254: U15.10 20.32,9.29 ExPort.1
GPIO10: length 5.2
  Top Layer w0.254: ExPort.2 17.78,9.29 U15.11
GPIO11: length 5.2
  Top Layer w0.254: U15.12 15.24,9.29 ExPort.3
GPIO12: length 5.2
  Top Layer w0.254: ExPort.4 12.7,9.29 U15.13
GPIO13: length 5.2
  Top Layer w0.254: ExPort.5 10.16,9.29 U15.14
OPC_GND: length 11.8
  Bottom Layer w0.254: 31.13,31.45 VCC2.2 ; 31.13,31.45 29.61,29.92 29.61,28.91 30.37,28.14 30.65,28.14 GND1.2 ; 31.13,31.45 31.39,31.45 31.9,31.95 31.9,32.21 32.91,33.22 35.16,33.22 Pantalla.1
OPC_VCC: length 10.1
  Bottom Layer w0.254: 35.81,30.79 34.54,30.79 GND2.2 ; 35.81,30.79 35.81,29.86 34.29,28.34 33.65,28.34 VCC1.2 ; 35.81,30.79 36.83,30.79 38.1,32.06 Pantalla.2
PD+: length 16.4
  Top Layer w0.254: 75.89,30.03 75.13,30.03 74.64,29.53 74.64,26.59 v1(75.15,26.08)
  Bottom Layer w0.254: v1(75.15,26.08) 75.4,25.83 75.4,23.03 ; 75.4,23.03 75.4,21.86 78.19,19.07 79.46,19.07 80.48,18.05 D2.1 ; 75.4,23.03 R4.2
PD-: length 17.3
  Top Layer w0.254: v1(75.79,20.34) 74.11,22.01 74.11,29.59 75.05,30.53 75.89,30.53
  Bottom Layer w0.254: 75.79,18.81 76.29,18.81 77.31,17.8 D2.3 ; 75.79,18.81 v1(75.79,20.34) ; 75.79,18.81 75.43,18.81 R18.2
VOUT: length 18.6
  Top Layer w0.254: v1(89.3,21.6) F1.2
  Bottom Layer w0.254: 89.22,20.25 88.46,20.25 88.2,20 FB3.2 84.45,19.93 C2.2 ; 89.22,20.25 90.35,20.25 R8.1 ; 89.22,20.25 89.22,21.52 v1(89.3,21.6)
VSYS: length 95.2
  Top Layer w0.254: v1(5.22,28.42) 5.98,28.42 6.74,29.18 6.74,30.7 U15.23
  Bottom Layer w0.254: 33.59,13.98 30.54,10.94 7.46,10.94 5.22,13.18 v1(5.22,28.42) ; 33.59,13.98 32.57,15 32.57,26.94 32.32,27.19 ; 33.59,13.98 C1.1 34.29,8.71 34.29,7.04 34.54,6.79 35.75,6.79 FB1.1 40.96,3.11 USB_B.1 ; 32.32,27.19 32.32,27.95 33.51,29.14 VCC1.1 ; 32.32,27.19 30.62,27.19 29.1,28.72 29.1,30.75 30.8,32.45 VCC2.1
$2N7232: length 2.5
  Bottom Layer w0.254: D3.2 R8.2
$2N7998: length 2.3
  Bottom Layer w0.254: FB2.1 36.58,15.23 C1.2
$2N8019: length 8.8
  Bottom Layer w0.254: U1.6 51.64,20.89 R1.2
$2N8020: length 8
  Bottom Layer w0.254: R2.2 57.29,22.03 U1.7
$2N8021: length 4.7
  Bottom Layer w0.254: R4.1 71.3,22.16 U1.10
$2N8022: length 5.2
  Bottom Layer w0.254: R18.1 70.15,20.89 U1.11
$2N8023: length 3.5
  Bottom Layer w0.254: D4.5 40.39,26.04 R5.1
$2N8024: length 2.7
  Bottom Layer w0.254: D2.5 R6.2
$2N8501: length 20.2
  Bottom Layer w0.254: L1.2 58.23,6.22 U11.2
$2N8502: length 15.7
  Top Layer w0.254: v1(71.37,8.2) 68.98,8.2 63.88,3.11
  Bottom Layer w0.254: v1(71.37,8.2) 71.62,8.45 75.94,8.45 L2.2
$2N13465: length 3.2
  Bottom Layer w0.254: U14.1 66.67,29.01 R20.1
$2N18746: length 19.1
  Top Layer w0.254: USB_IN1.1 85.48,14.21 85.48,20.09 82.91,22.66 F1.1

## Copper pours and planes (outline as drawn; the poured copper is in the pictures)
GND on Top Layer: 0,33.59 60.38,33.59 60.38,0 0,0
GND on Bottom Layer: 0,33.59 60.29,33.59 60.29,0 0,0
GND2 on Top Layer: 64.78,33.71 92.46,33.71 92.46,0.03 64.78,0.03
GND2 on Bottom Layer: 64.87,33.71 92.46,33.71 92.46,0.03 64.87,0.03

Small or netless copper shapes (teardrops, artwork), in the pictures only: 95 on Top Layer, 173 on Bottom Layer

## Text on the board
Bottom Silkscreen Layer: <---No USBKiller from here---->
Top Silkscreen Layer: GP9 | VCC | Vcc | D+ | D- | GND | Fuse | Cerberus V1
